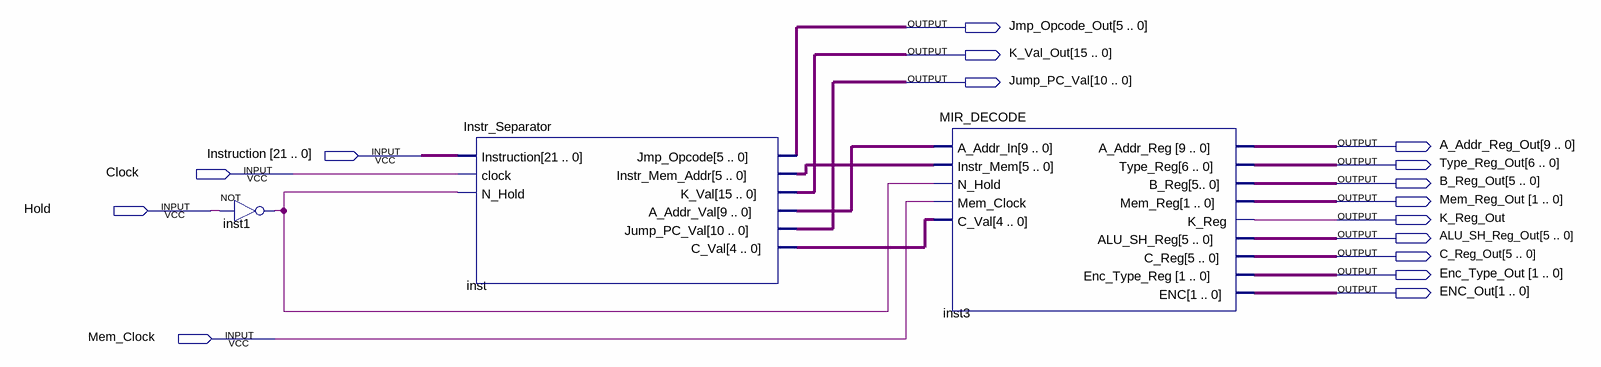
[diagram p0: schematic sheet]
// Quartus schematic Decode_Unit.bdf as structural Verilog: 3 symbols, 16 pins
module Decode_Unit (
  input  [21:0] Instruction,
  input  Clock,
  input  Hold,
  input  Mem_Clock,
  output [5:0] Jmp_Opcode_Out,
  output [15:0] K_Val_Out,
  output [10:0] Jump_PC_Val,
  output [9:0] A_Addr_Reg_Out,
  output [6:0] Type_Reg_Out,
  output [5:0] B_Reg_Out,
  output [1:0] Mem_Reg_Out,
  output K_Reg_Out,
  output [5:0] ALU_SH_Reg_Out,
  output [5:0] C_Reg_Out,
  output [1:0] Enc_Type_Out,
  output [1:0] ENC_Out
);

  wire inst1_out;
  wire [4:0] inst_c_val;
  wire [5:0] inst_instr_mem_addr;
  wire [9:0] inst_a_addr_val;

  not inst1 (inst1_out, Hold);
  Instr_Separator inst (
    .Instruction(Instruction), .clock(Clock), .N_Hold(inst1_out), .Jmp_Opcode(Jmp_Opcode_Out),
    .Instr_Mem_Addr(inst_instr_mem_addr), .K_Val(K_Val_Out), .A_Addr_Val(inst_a_addr_val),
    .Jump_PC_Val(Jump_PC_Val), .C_Val(inst_c_val));
  MIR_DECODE inst3 (
    .A_Addr_In(inst_a_addr_val), .Instr_Mem(inst_instr_mem_addr), .N_Hold(inst1_out), .Mem_Clock(Mem_Clock),
    .C_Val(inst_c_val), .A_Addr_Reg(A_Addr_Reg_Out), .Type_Reg(Type_Reg_Out), .B_Reg(B_Reg_Out),
    .Mem_Reg(Mem_Reg_Out), .K_Reg(K_Reg_Out), .ALU_SH_Reg(ALU_SH_Reg_Out), .C_Reg(C_Reg_Out),
    .Enc_Type_Reg(Enc_Type_Out), .ENC(ENC_Out));
endmodule
